# Altium schematic sheet Arbitrary-Waveform-Generator.SchDoc
size A4; DocumentNumber: 6; SheetNumber: 6; SheetTotal: 6
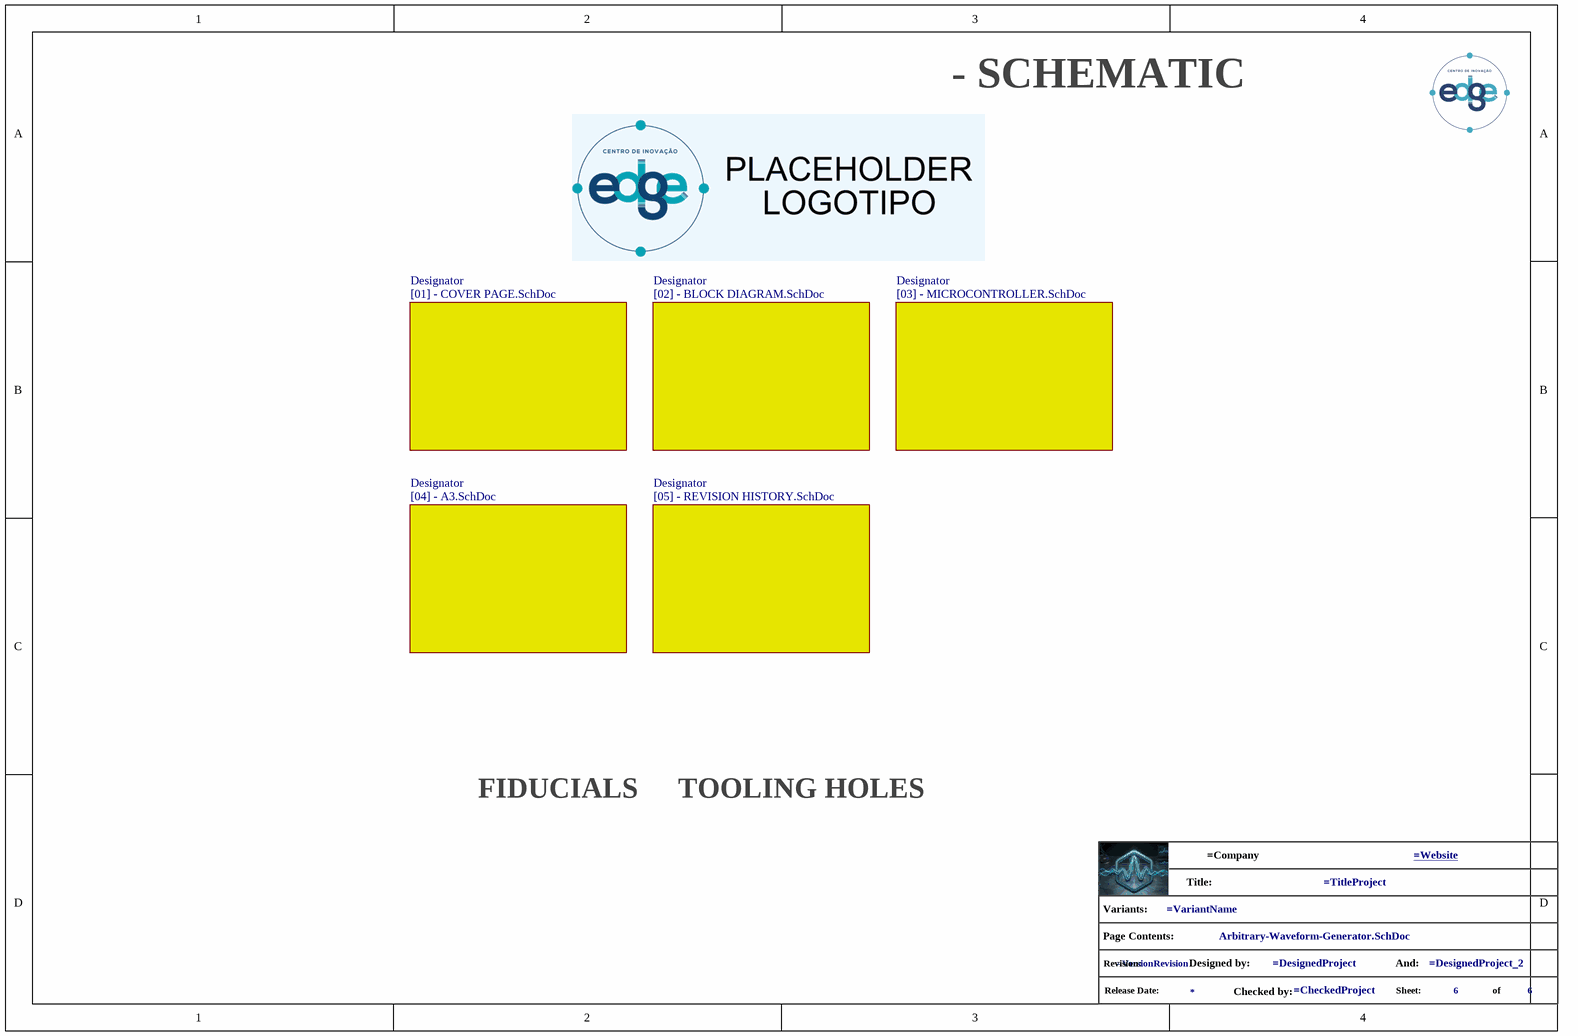
[diagram p0: Arbitrary-Waveform-Generator.SchDoc]

## Parts
*?  info_project  (value not drawn)  (graphical)

## Sub-sheets
Designator = [02] - BLOCK DIAGRAM.SchDoc: no entries
Designator = [03] - MICROCONTROLLER.SchDoc: no entries
Designator = [01] - COVER PAGE.SchDoc: no entries
Designator = [04] - A3.SchDoc: no entries
Designator = [05] - REVISION HISTORY.SchDoc: no entries

## Notes on the sheet
- - SCHEMATIC
- FIDUCIALS
- TOOLING HOLES
- (in symbol info_project) Title:; Variants:; Page Contents:; Revision:; Designed by:; And:; Release Date:; Checked by:; Sheet:; of

## Library data of the parts
*? = info_project: GRAPHICAL - Info Project